# Altium schematic sheet BC20_Module_V1.0.SchDoc
size A3
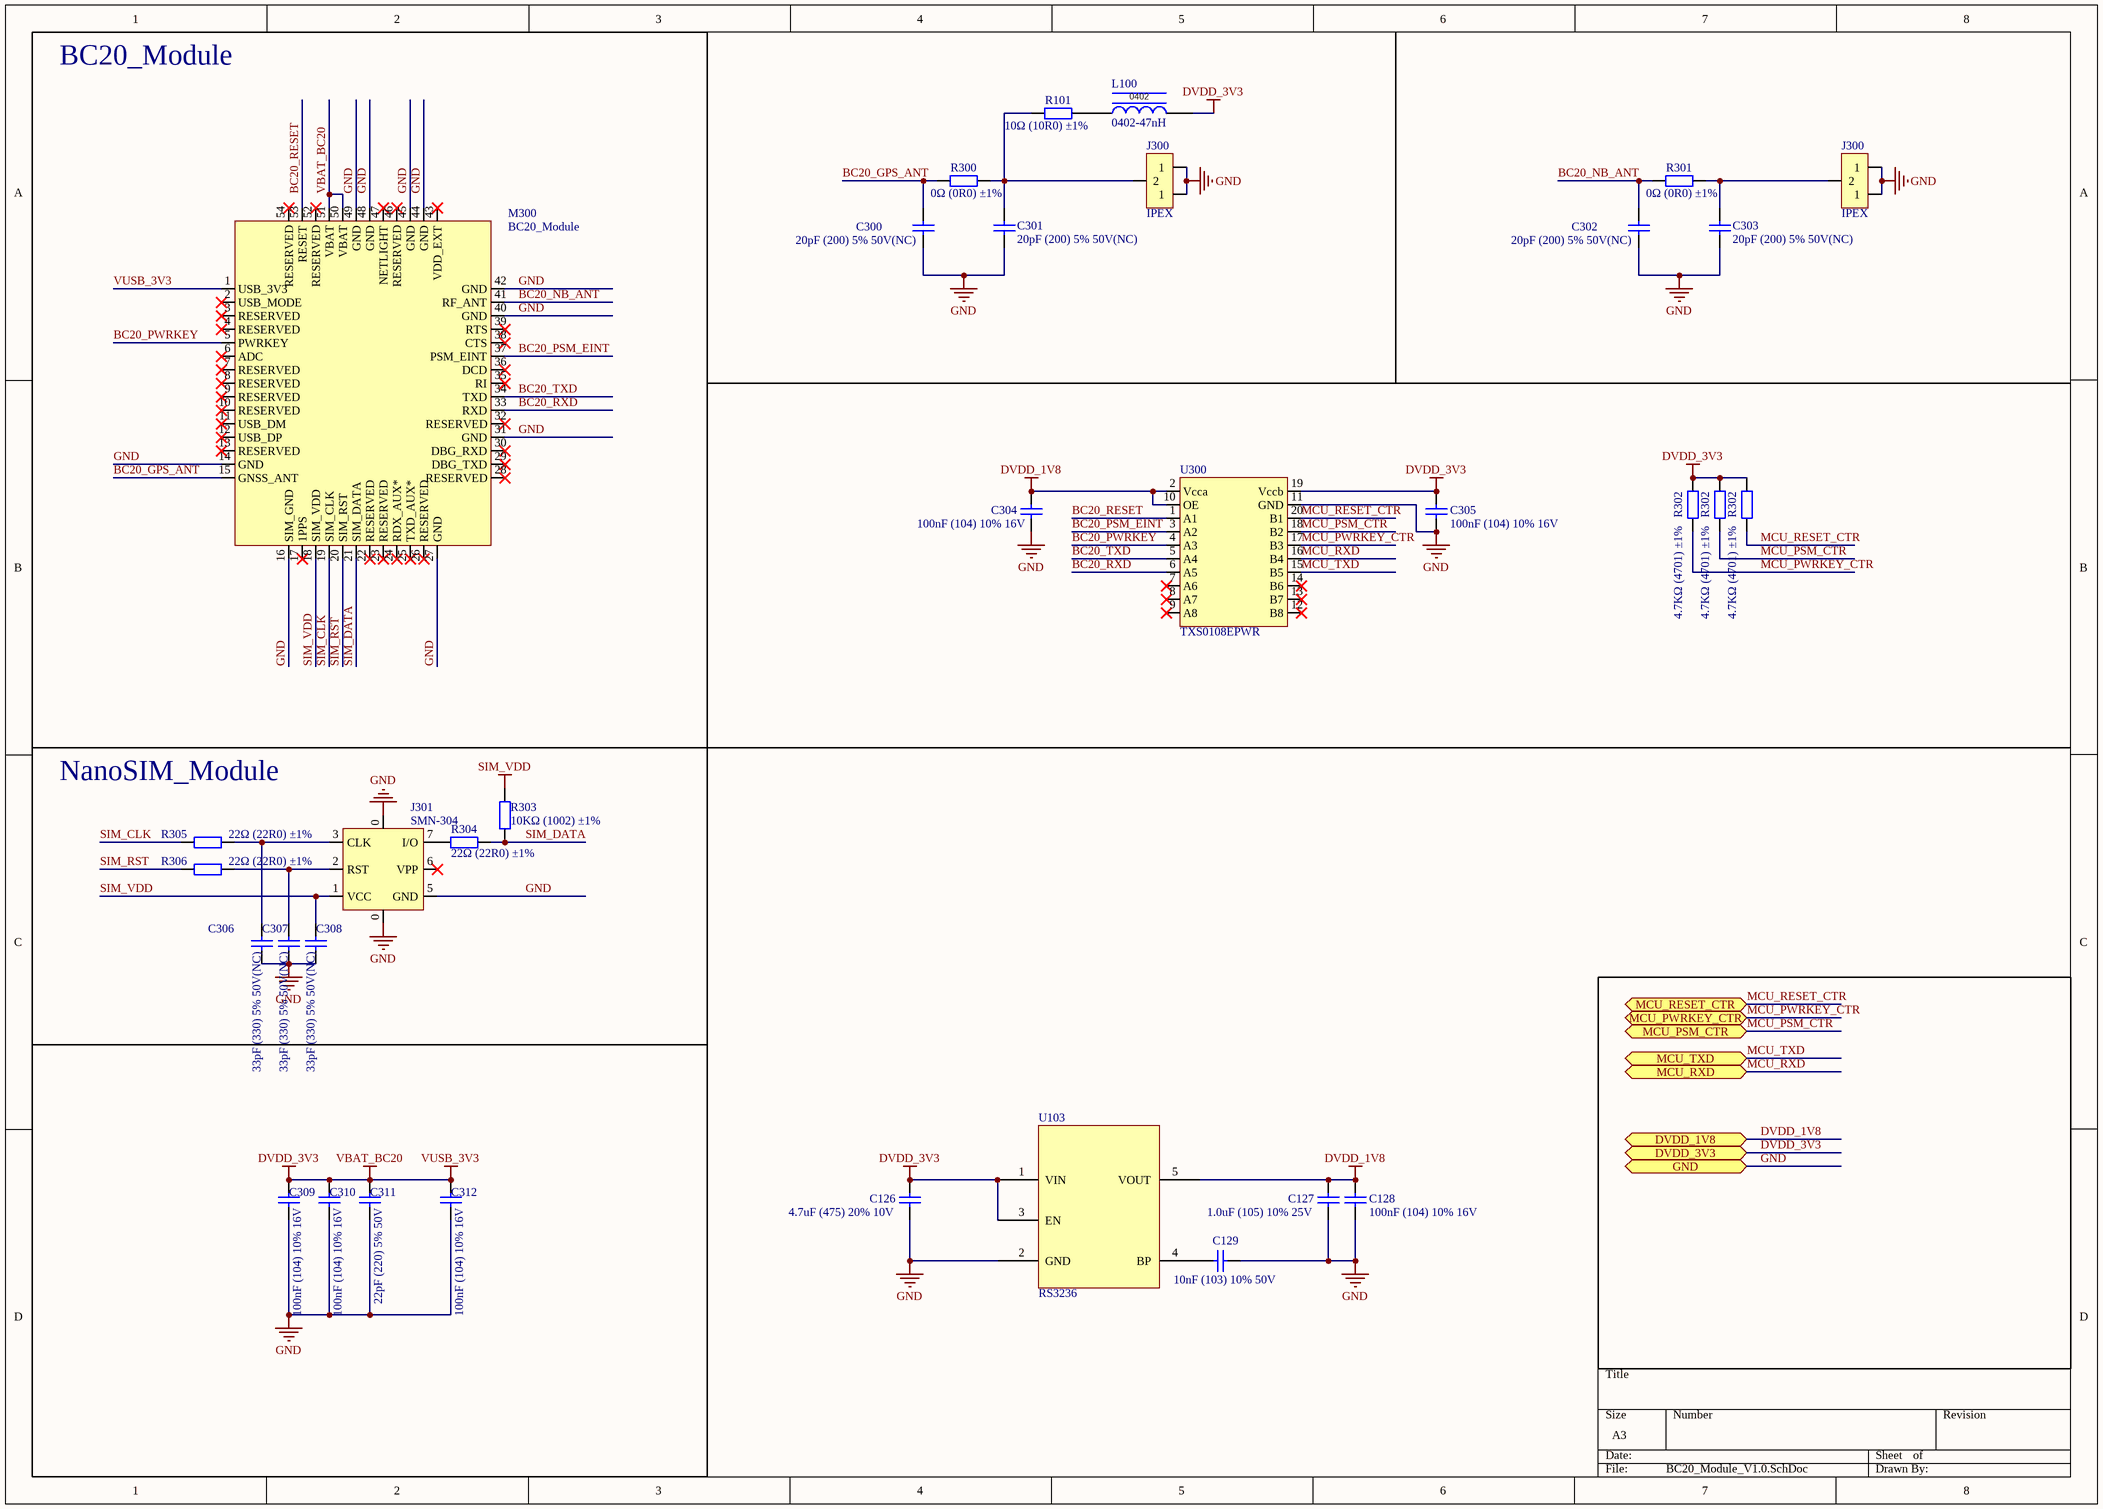
[diagram p0: BC20_Module_V1.0.SchDoc]

## Parts
(Parts that share a designator on the sheet are numbered #1, #2 ... from top to bottom, then left to right.)
C126  4.7uF (475) 20% 10V  [0402_C]
C127  1.0uF (105) 10% 25V  [0402_C]
C128  100nF (104) 10% 16V  [0402_C]
C129  10nF (103) 10% 50V  [0402_C]
C300  20pF (200) 5% 50V(NC)  [0402_C]
C301  20pF (200) 5% 50V(NC)  [0402_C]
C302  20pF (200) 5% 50V(NC)  [0402_C]
C303  20pF (200) 5% 50V(NC)  [0402_C]
C304  100nF (104) 10% 16V  [0402_C]
C305  100nF (104) 10% 16V  [0402_C]
C306  33pF (330) 5% 50V(NC)  [0402_C]
C307  33pF (330) 5% 50V(NC)  [0402_C]
C308  33pF (330) 5% 50V(NC)  [0402_C]
C309  100nF (104) 10% 16V  [0402_C]
C310  100nF (104) 10% 16V  [0402_C]
C311  22pF (220) 5% 50V  [0402_C]
C312  100nF (104) 10% 16V  [0402_C]
J300#1  IPEX  [IPEX]
J300#2  IPEX  [IPEX]
J301  SMN-304  [SMN-304]
L100  0402-47nH  [0402_L]
M300  BC20_Module  [BC20_Module]
R101  10Ω (10R0) ±1%  [0402_R]
R300  0Ω (0R0) ±1%  [0402_R]
R301  0Ω (0R0) ±1%  [0402_R]
R302#1  4.7KΩ (4701) ±1%  [0402_R]
R302#2  4.7KΩ (4701) ±1%  [0402_R]
R302#3  4.7KΩ (4701) ±1%  [0402_R]
R303  10KΩ (1002) ±1%  [0402_R]
R304  22Ω (22R0) ±1%  [0402_R]
R305  22Ω (22R0) ±1%  [0402_R]
R306  22Ω (22R0) ±1%  [0402_R]
U103  RS3236  [SOT-23-5]
U300  TXS0108EPWR  [TSSOP-20]

## Blocks framed on the sheet
BC20_Module: M300

## Ports
DVDD_1V8, DVDD_3V3, GND, MCU_PSM_CTR, MCU_PWRKEY_CTR, MCU_RESET_CTR, MCU_RXD, MCU_TXD

## Nets
DVDD_1V8: C127.2 C128.2 C304.2 U103.5(VOUT) U300.2(Vcca) U300.10(OE) ; port DVDD_1V8
DVDD_3V3: C126.2 C305.2 C309.2 C310.2 C311.2 C312.2 L100.2 M300.1(USB_3V3) M300.50(VBAT) M300.51(VBAT) R302#1.2 R302#2.2 R302#3.2 U103.1(VIN) U103.3(EN) U300.19(Vccb) ; port DVDD_3V3  [also labelled VBAT_BC20, VUSB_3V3]
GND: C126.1 C127.1 C128.1 C129.1 C300.1 C301.1 C302.1 C303.1 C304.1 C305.1 C306.1 C307.1 C308.1 C309.1 C310.1 C311.1 C312.1 J300#1.1 J300#2.1 J301.0(GND) J301.5(GND) M300.14(GND) M300.16(SIM_GND) M300.27(GND) M300.31(GND) M300.40(GND) M300.42(GND) M300.44(GND) M300.45(GND) M300.48(GND) M300.49(GND) U103.2(GND) U300.11(GND) ; port GND
SIM_VDD: C308.2 J301.1(VCC) M300.18(SIM_VDD) R303.2
BC20_GPS_ANT: C300.2 M300.15(GNSS_ANT) R300.1
BC20_NB_ANT: C302.2 M300.41(RF_ANT) R301.1
BC20_PSM_EINT: M300.37(PSM_EINT) U300.3(A2)
BC20_PWRKEY: M300.5(PWRKEY) U300.4(A3)
BC20_RESET: M300.53(RESET) U300.1(A1)
BC20_RXD: M300.33(RXD) U300.6(A5)
BC20_TXD: M300.34(TXD) U300.5(A4)
MCU_PSM_CTR: R302#2.1 U300.18(B2) ; port MCU_PSM_CTR
MCU_PWRKEY_CTR: R302#1.1 U300.17(B3) ; port MCU_PWRKEY_CTR
MCU_RESET_CTR: R302#3.1 U300.20(B1) ; port MCU_RESET_CTR
MCU_RXD: U300.16(B4) ; port MCU_RXD
MCU_TXD: U300.15(B5) ; port MCU_TXD
SIM_CLK: M300.19(SIM_CLK) R305.1
SIM_DATA: M300.21(SIM_DATA) R303.1 R304.2
SIM_RST: M300.20(SIM_RST) R306.1
NetC129_2: C129.2 U103.4(BP)
NetC301_2: C301.2 J300#1.2 R101.1 R300.2
NetC303_2: C303.2 J300#2.2 R301.2
NetC306_2: C306.2 J301.3(CLK) R305.2
NetC307_2: C307.2 J301.2(RST) R306.2
NetJ301_7: J301.7(I/O) R304.1
NetL100_1: L100.1 R101.2

Not connected (* = marked no-connect by the designer): J301 6(VPP)*; M300 2(USB_MODE)* 3(RESERVED)* 4(RESERVED)* 6(ADC)* 7(RESERVED)* 8(RESERVED)* 9(RESERVED)* 10(RESERVED)* 11(USB_DM)* 12(USB_DP)* 13(RESERVED)* 17(1PPS)* 22(RESERVED)* 23(RESERVED)* 24(RDX_AUX*)* 25(TXD_AUX*)* 26(RESERVED)* 28(RESERVED)* 29(DBG_TXD)* 30(DBG_RXD)* 32(RESERVED)* 35(RI)* 36(DCD)* 38(CTS)* 39(RTS)* 43(VDD_EXT)* 46(RESERVED)* 47(NETLIGHT)* 52(RESERVED)* 54(RESERVED)*; U300 7(A6)* 8(A7)* 9(A8)* 12(B8)* 13(B7)* 14(B6)*

## Notes on the sheet
- NanoSIM_Module
- (in symbol 0402 100Ω 25% 100MHz) 0402

## Library data of the parts
C126 = 0402 4.7uF (475) 20% 10V: 贴片电容; ComponentLink1Description: 供应商链接; ComponentLink1URL: http://www.szlcsc.com/product/details_24469.html; Package: 0402; Supplier: LC; SuppliersPartNumber: C23733
C127 = 0402 1.0uF (105) 10% 25V: 贴片电容; ComponentLink1Description: 供应商链接; ComponentLink1URL: http://www.szlcsc.com/product/details_53938.html; Package: 0402; Supplier: LC; SuppliersPartNumber: C52923
C128 C304 C305 C309 C310 C312 = 0402 100nF (104) 10% 16V: 贴片电容; ComponentLink1Description: 供应商链接; ComponentLink1URL: http://www.szlcsc.com/product/details_1877.html; Package: 0402; Supplier: LC; SuppliersPartNumber: C1525
C129 = 0402 10nF (103) 10% 50V: 贴片电容; ComponentLink1Description: 供应商链接; ComponentLink1URL: http://www.szlcsc.com/product/details_15869.html; Package: 0402; Supplier: LC; SuppliersPartNumber: C15195
C300-C303 = 0402 20pF (200) 5% 50V: 贴片电容; ComponentLink1Description: 供应商链接; ComponentLink1URL: http://www.szlcsc.com/product/details_1906.html; Package: 0402; Supplier: LC; SuppliersPartNumber: C1554
C306-C308 = 0402 33pF (330) 5% 50V: 贴片电容; ComponentLink1Description: 供应商链接; ComponentLink1URL: http://www.szlcsc.com/product/details_1914.html; Package: 0402; Supplier: LC; SuppliersPartNumber: C1562
C311 = 0402 22pF (220) 5% 50V: 贴片电容; ComponentLink1Description: 供应商链接; ComponentLink1URL: http://www.szlcsc.com/product/details_1907.html; Package: 0402; Supplier: LC; SuppliersPartNumber: C1555
J301 = SMN-304: nano-sim-base
L100 = 0402 100Ω 25% 100MHz: 贴片电感
R101 = 0402 10Ω (10R0) 1%: 贴片电阻; ComponentLink1Description: 供应商链接; ComponentLink1URL: http://www.szlcsc.com/product/details_25820.html; Package: 0402; Supplier: LC; SuppliersPartNumber: C25077
R300 R301 = 0402 0Ω (0R0) 1%: 贴片电阻; ComponentLink1Description: 供应商链接; ComponentLink1URL: http://www.szlcsc.com/product/details_17853.html; Package: 0402; Supplier: LC; SuppliersPartNumber: C17168
R302#1-R302#3 = 0402 4.7KΩ (4701) 1%: 贴片电阻; ComponentLink1Description: 供应商链接; ComponentLink1URL: http://www.szlcsc.com/product/details_26643.html; Package: 0402; Supplier: LC; SuppliersPartNumber: C25900
R303 = 0402 10KΩ (1002) 1%: 贴片电阻; ComponentLink1Description: 供应商链接; ComponentLink1URL: http://www.szlcsc.com/product/details_26487.html; Package: 0402; Supplier: LC; SuppliersPartNumber: C25744
R304-R306 = 0402 22Ω (22R0) 1%: 贴片电阻; ComponentLink1Description: 供应商链接; ComponentLink1URL: http://www.szlcsc.com/product/details_25835.html; Package: 0402; Supplier: LC; SuppliersPartNumber: C25092
U103 = LDO_1.8V